# EAGLE design timer6 (EAGLE 5.07)
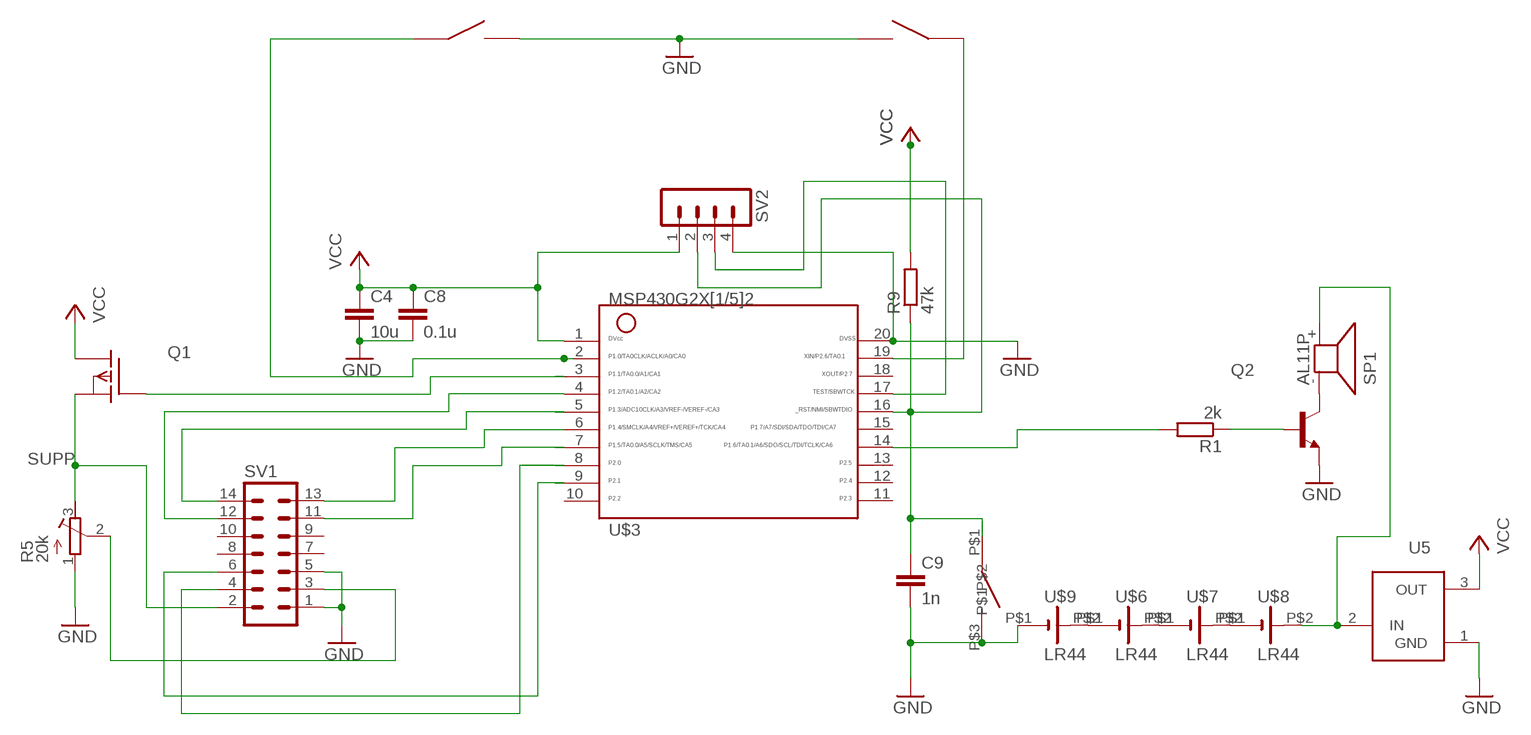
[diagram p0: schematic, sheet 1]

## Parts
C4  10u  C-EUC0603  [C0603]
C8  0.1u  C-EU025-025X050  [C025-025X050]
C9  1n  C-EU150-054X183  [C150-054X183]
Q1  TP0604N3  [TO-92]
Q2  2N3565  [TO92]
R1  2k  R-EU_R1206  [R1206]
R5  20k  R-TRIMM3339P  [RTRIM3339P]
R9  47k  R-EU_0207/10  [0207/10]
SP1  AL11P  [AL11P]
SV1  LCD_NHD  [HEADER_7_2]
SV2  MA04-1  [MA04-1]
U$1  BOUTTONROND  [BOUTTONROND]
U$2  BOUTTONROND  [BOUTTONROND]
U$3  G2X[1/5]2---N20  [N20]
U$4  BOUTTONSMT  [BUTTONSMT]
U$5  MCP1700-2502E  [TO92]
U$6  LR44  [LR44]
U$7  LR44  [LR44]
U$8  LR44  [LR44]
U$9  LR44  [LR44]

## Nets
GND: C4.2 C8.2 C9.2 Q2.3(E) R5.1(E) SV1.1 SV1.5 SV2.4 U$1.P$3 U$2.P$3 U$3.20 U$4.P$3 U$5.1(GND) U$9.P$1(-)
N$1: Q1.2(G) U$3.3
N$2: SV2.3 U$3.17
N$3: SV1.12 U$3.4
N$4: SV1.14 U$3.5
N$5: SV1.11 U$3.7
N$6: SV1.13 U$3.6
N$9: U$2.P$1 U$3.19
N$10: SV1.4 U$3.8
N$11: SV1.6 U$3.9
N$12: Q2.2(B) R1.1
N$13: C9.1 R9.1 SV2.2 U$3.16 U$4.P$1
N$14: Q2.1(C) SP1.-
N$15: R1.2 U$3.14
N$16: SP1.+ U$5.2(IN) U$8.P$2(+)
N$17: R5.2(S) SV1.3
N$29: U$6.P$2(+) U$7.P$1(-)
N$30: U$1.P$1 U$3.2
N$31: U$7.P$2(+) U$8.P$1(-)
N$32: U$6.P$1(-) U$9.P$2(+)
SUPP: Q1.1(S) R5.3(A) SV1.2
VCC: C4.1 C8.1 Q1.3(D) R9.2 SV2.1 U$3.1 U$5.3(OUT)
Unconnected: SV1.7 SV1.8 SV1.9 SV1.10 U$3.10 U$3.11 U$3.12 U$3.13 U$3.15 U$3.18

## Notes on the sheet
- U5

## Library data of the parts
C4 C8 C9 = resistor:C-EU: CAPACITOR, European symbol
Q1 = transistor-fet:TP0604N3: P-Channel Enhancement MOSFET -40V; -2A; 2,0Ohm
Q2 = transistor-npn:2N3565: NPN Transistor
R1 R9 = resistor:R-EU_: RESISTOR, European symbol
R5 = resistor:R-TRIMM: Trimm resistor
SP1 = buzzer:AL11P: SPEAKER Source: Buerklin
SV1 = mbonnin:LCD_NHD
SV2 = con-lstb:MA04-1: PIN HEADER
U$1 U$2 = mbonnin:BOUTTONROND
U$3 = TI_MSP430_v16:G2X[1/5]2---N20: MSP430G2X[1/5]2 MSP430G2x52, MSP430G2x12 PDIP (N) 20 Pin Package http://focus.ti.com/docs/prod/folders/print/msp430g2452.html
U$4 = mbonnin:BOUTTONSMT
U$5 = mbonnin:MCP1700-2502E
U$6-U$9 = mbonnin:LR44

## Board
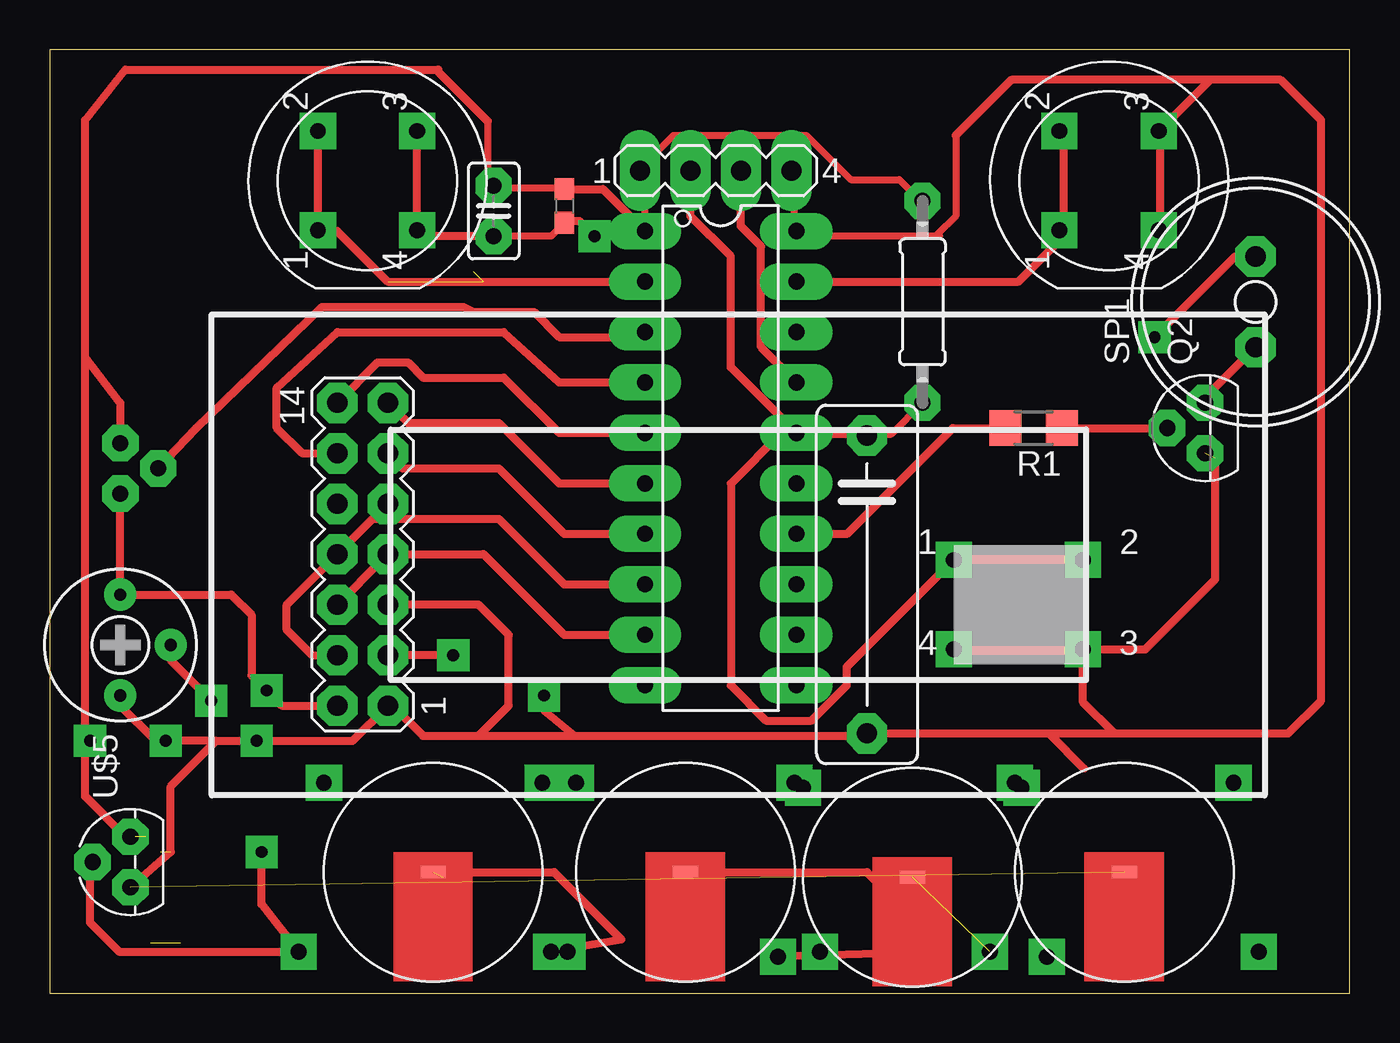
[diagram p1: board, top side]
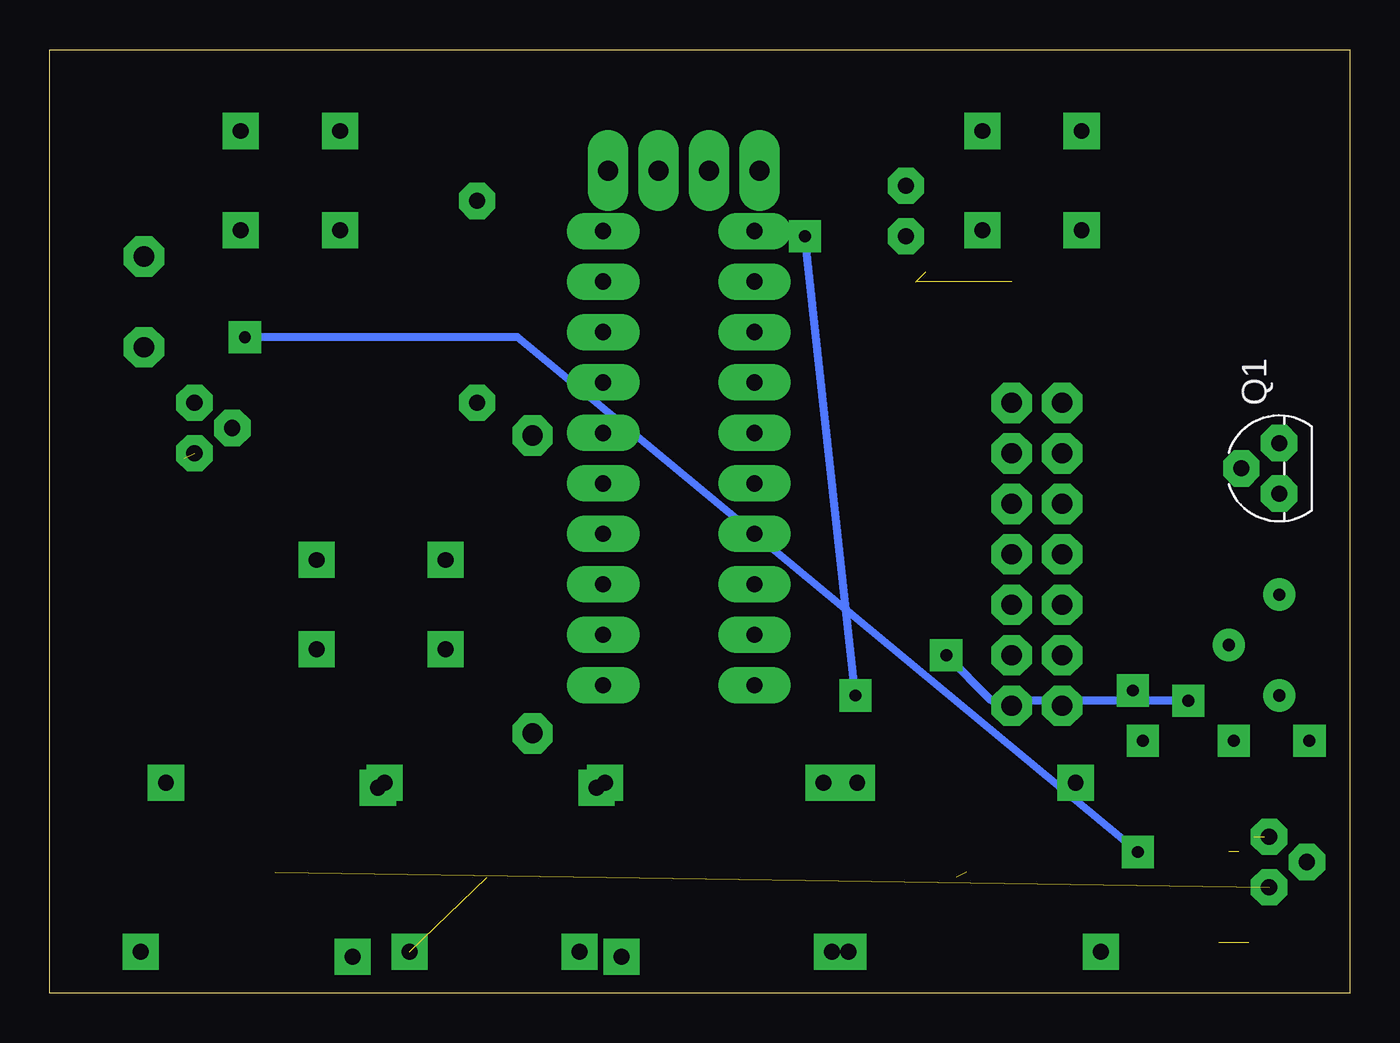
[diagram p2: board, bottom side, seen from below]

Size 65.46 x 47.49 mm. Coordinates in mm from the lower left corner, seen from the top.
Outline: 0,0 65.46,0 65.46,47.49 0,47.49 0,0
Copper layers (1*16): Top 0.035mm / dielectric 1.5mm / Bottom 0.035mm
Design rules "martin *": minimum track width 14mil, minimum drill 16mil, track to track 14mil, track to pad 20mil, pad to pad 8mil, via to via 8mil, smd to smd 8mil, copper to edge 8mil, drill to drill 8mil, minimum pad ring 20mil, minimum via ring 20mil, stop-mask expansion 4mil, vias tented up to drill 0mil, thermal gap 10mil

### Footprints (pad centres in the part's own frame; a part is rotated, then mirrored left to right if it is on the bottom)
C0603 = smd 1.1 x 1: 1 -0.85,0; 2 0.85,0
C025-025X050 = drill 0.813 octagon: 1 -1.27,0; 2 1.27,0
C150-054X183 = drill 1.016 octagon: 1 -7.493,0; 2 7.493,0
TO-92 = drill 0.813 octagon: 1 -1.27,0; 2 0,1.905; 3 1.27,0
TO92 = drill 0.813 octagon: 1 1.27,0; 2 0,1.905; 3 -1.27,0
R1206 = smd 1.6 x 1.803: 1 -1.422,0; 2 1.422,0
RTRIM3339P = drill 0.61 round: 1 -2.54,0; 2 0,-2.54; 3 2.54,0
0207/10 = drill 0.813 octagon: 1 -5.08,0; 2 5.08,0
AL11P = drill 1.016 pad 1.905 octagon: + 2.286,0; - -2.286,0
HEADER_7_2 = drill 1.016 octagon: 1 -7.625,-1.28; 2 -7.625,1.26; 3 -5.085,-1.28; 4 -5.085,1.26; 5 -2.545,-1.28; 6 -2.545,1.26; 7 -0.005,-1.28; 8 -0.005,1.26; 9 2.535,-1.28; 10 2.535,1.26; 11 5.075,-1.28; 12 5.075,1.26; 13 7.615,-1.28; 14 7.615,1.26
MA04-1 = drill 1.016 long: 1 -3.81,0; 2 -1.27,0; 3 1.27,0; 4 3.81,0
BOUTTONROND = drill 0.8 square: P$1 2.5,2.5; P$2 -2.5,2.5; P$3 2.5,-2.5; P$4 -2.5,-2.5
N20 = drill 0.813 long: 1 -11.435,-3.81; 2 -8.895,-3.81; 3 -6.355,-3.81; 4 -3.815,-3.81; 5 -1.275,-3.81; 6 1.265,-3.81; 7 3.805,-3.81; 8 6.345,-3.81; 9 8.885,-3.81; 10 11.425,-3.81; 11 11.425,3.81; 12 8.885,3.81; 13 6.345,3.81; 14 3.805,3.81; 15 1.265,3.81; 16 -1.275,3.81; 17 -3.815,3.81; 18 -6.355,3.81; 19 -8.895,3.81; 20 -11.435,3.81
BUTTONSMT = drill 0.8 square: P$1 -3.25,2.25; P$2 3.25,2.25; P$3 3.25,-2.25; P$4 -3.25,-2.25
TO92' = drill 0.813 octagon: 1 2.54,1.27; 2 3.81,3.175; 3 5.08,1.27
LR44 = smd 1.27 x 0.635: P$1 0,0 | drill 0.8 square: P$2 -6.77,-4; P$3 -5.5,4.5; P$4 5.5,4.5; P$5 6.77,-4

### Placement (x,y rotation side)
C4  25.91,39.62 270 top
C8  22.35,39.37 270 top
C9  41.15,20.57 270 top
Q1  3.56,26.42 90 bottom
Q2  58.17,28.45 90 top
R1  49.53,28.45 180 top
R5  3.56,17.53 90 top
R9  43.94,34.8 90 top
SP1  60.71,34.8 90 top
SV1  15.75,22.1 90 top
SV2  33.53,41.4 0 top
U$1  16,40.89 90 top
U$2  53.34,40.89 90 top
U$3  33.78,26.92 270 top
U$4  48.77,19.56 0 top
U$5  MCP1700-2502E  [TO92']  5.33,2.79 90 top
U$6  43.43,5.84 0 top
U$7  32,6.1 0 top
U$8  19.3,6.1 0 top
U$9  54.1,6.1 0 top

### Tracks (layer width: path | path; a pad name or v marks a point on that pad's centre or on a via)
GND  (via drill 0.6)  (2 unrouted)
  Top 0.356: SV2.4 37.49,41.35 37.49,38.51 U$3.20 37.69,38.3 37.9,38.1 44.6,38.1 44.7,38.2 | C4.2 25.86,38.71 25.25,38.1 C8.2 | 44.7,38.2 45.62,39.12 45.62,43.18 | 44.7,38.2 44.81,38.1 | C9.2 40.74,13.72
  Top 0.406: C4.2 26.07,38.77 26.16,38.86 26.67,38.86 v27.43,38.1 | R5.1 3.56,14.48 5.33,12.7 v5.84,12.7 8.38,12.7 | 8.38,12.7 v10.41,12.7 15.24,12.7 SV1.1 17.27,14.48 18.8,12.95 21.59,12.95 | 21.59,12.95 26.42,12.95 | 26.42,12.95 41.02,12.95 C9.2 50.29,13.08 | SV1.5 21.59,19.56 23.11,18.03 23.11,14.48 21.59,12.95 | 58.42,45.97 48.41,45.97 45.62,43.18 | v24.89,14.99 24.89,14.22 26.42,12.95 | U$5.1 6.1,7.11 6.1,10.41 8.38,12.7 | 50.29,13.08 53.59,13.08 | 53.59,13.08 62.36,13.08 64.01,14.73 64.01,43.94 61.98,45.97 58.42,45.97 | 53.59,13.08 52.02,14.66 U$4.P$3 55.15,17.31 58.67,20.83 58.67,26.92 | U$1.P$3 18.5,38.65 18.8,38.35 19.05,38.35 19.3,38.1 C8.2 | 58.42,45.97 U$2.P$3 | 50.29,13.08 52.07,11.3
  Bottom 0.406: v24.89,14.99 v27.43,38.1
N$1
  Top 0.406: Q1.2 7.37,28.45 13.72,34.54 20.83,34.54 21.34,34.29 24.38,34.29 25.65,33.02 29.71,33.02 U$3.3
N$2
  Top 0.406: SV2.3 34.8,38.61 35.81,37.59 35.81,32.52 U$3.17
N$3
  Top 0.406: U$3.4 25.65,30.74 22.86,33.27 14.48,33.27 11.43,30.48 11.43,28.45 12.7,27.18 SV1.12
N$4
  Top 0.406: U$3.5 25.65,28.2 22.86,30.99 18.8,30.99 18.03,31.75 16.51,31.75 SV1.14
N$5
  Top 0.406: U$3.7 25.9,23.12 22.61,26.42 17.78,26.42 SV1.11
N$6
  Top 0.406: U$3.6 25.65,25.66 22.61,28.7 18.03,28.7 SV1.13
N$9
  Top 0.406: U$3.19 48.77,35.82 51.05,38.1 51.05,43.18 U$2.P$1
N$10
  Top 0.406: U$3.8 25.9,20.58 22.61,23.88 16.26,23.88 11.94,19.56 11.94,18.29 13.21,17.02 SV1.4
N$11
  Top 0.406: U$3.9 25.9,18.04 21.84,22.1 17.27,22.1 17.02,21.84 16.76,21.84 SV1.6
N$12
  Top 0.406: R1.1 Q2.2
N$13
  Top 0.356: 41.15,28.14 37.69,28.14 U$3.16 37.49,28.35 | 41.15,28.14 42.37,28.14 R9.1 | 41.15,28.14 C9.1
  Top 0.406: SV2.2 32.26,39.12 34.29,37.08 34.29,31.5 U$3.16 36.84,28.2 34.29,25.65 34.29,15.49 36.07,13.72 38.35,13.72 40.13,15.49 40.13,16.42 U$4.P$1
N$14
  Top 0.406: Q2.1 58.17,29.97 SP1.-
N$15
  Top 0.406: R1.2 45.47,28.45 40.13,23.11 37.34,23.11 37.08,22.86 37.33,22.86 U$3.14
N$16  (via drill 0.6)
  Top 0.406: U$5.2 2.03,6.48 2.03,3.56 3.49,2.1 U$8.P$2 10.67,4.47 v10.67,7.11 | SP1.+ 59.69,37.08 v55.63,33.02
  Bottom 0.406: v55.63,33.02 41.91,33.02 v10.67,7.11
N$17  (via drill 0.6)
  Top 0.406: R5.2 6.1,16.76 v8.13,14.73 | v20.32,17.02 SV1.3
  Bottom 0.406: v8.13,14.73 18.03,14.73 v20.32,17.02
N$20
  Top 0.406: 45.72,21.84 52.07,21.84
N$21
  Top 0.406: 45.21,17.27 52.83,17.27
N$24  (1 unrouted)
N$25  (1 unrouted)
N$26  (1 unrouted)
N$28
  Top 0.406: 55.88,43.18 55.88,38.1
N$29
  Top 0.406: 33.78,5.84 U$7.P$1 41.15,6.1 45.15,2.1 U$6.P$2
N$30  (2 unrouted)
  Top 0.406: U$3.2 17.02,35.81 14.48,38.35 13.46,38.35 13.5,38.39 U$1.P$1
N$31  (1 unrouted)
  Top 0.406: 19.81,5.84 20.07,6.1 25.4,6.1 28.79,2.71 U$7.P$2
N$32  (1 unrouted)
N$37  (via drill 0.6)
  other vias: 2.03,12.7
SUPP  (via drill 0.6)
  Top 0.406: SV1.2 11.68,14.48 v10.92,15.24 10.16,16 10.16,19.05 9.14,20.07 R5.3 Q1.1
VCC
  Top 0.356: U$3.1 29.97,41.35 29.77,41.35 SV2.1 29.77,41.55 31.39,43.18 38.1,43.18 40.34,40.95 42.77,40.95 43.79,39.93 R9.2 | C4.1 25.86,40.54 22.4,40.54 C8.1 | 22.05,40.28 22.2,40.54 C8.1 | 22.05,43.89 22.05,40.28 | 22.05,40.28 C8.1
  Top 0.406: 1.78,32 3.5,29.77 3.56,29.72 Q1.3 | 1.78,32 1.78,43.94 3.81,46.48 19.56,46.48 19.56,46.38 22.05,43.89 | C4.1 27.86,40.47 U$3.1 | U$5.3 3.81,7.87 1.78,9.91 1.78,32